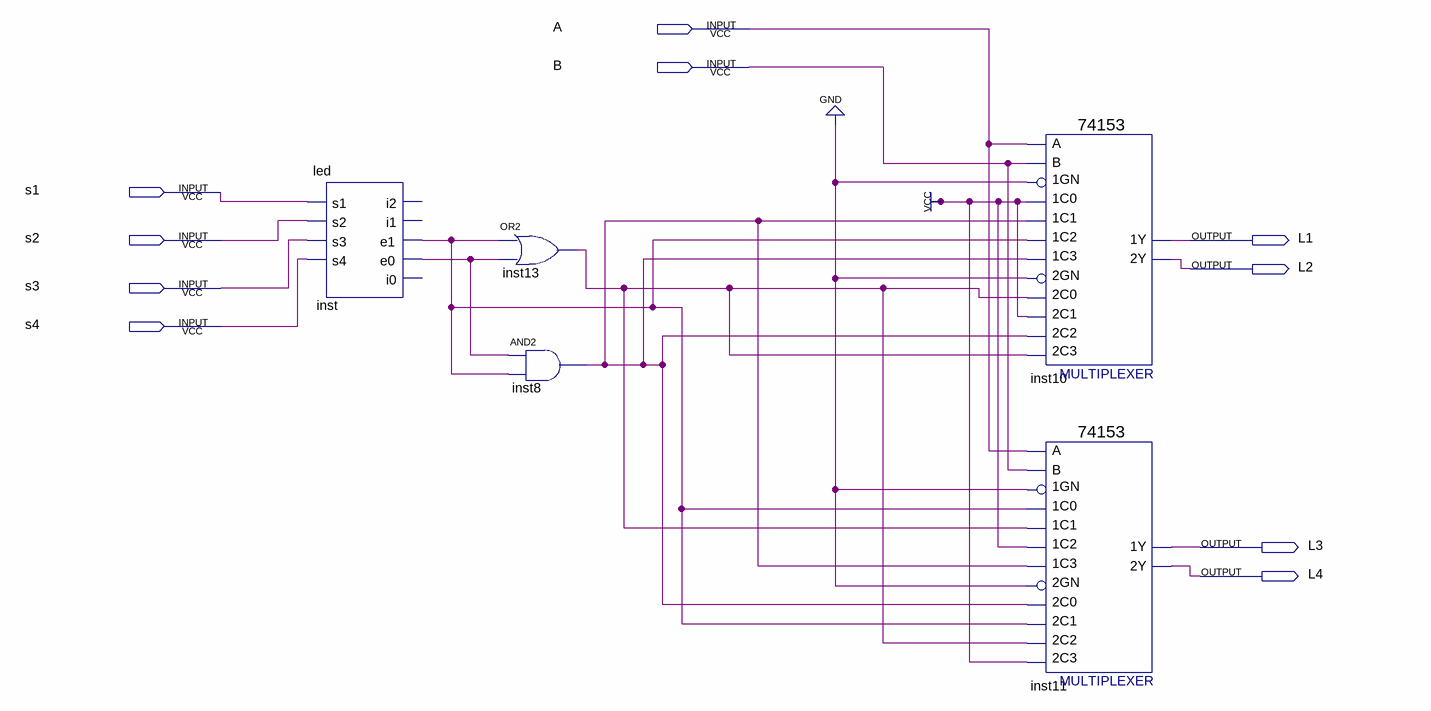
[diagram p0: schematic sheet]
// Quartus schematic finalversion.bdf as structural Verilog: 5 symbols, 10 pins
module finalversion (
  input  A,
  input  B,
  input  s1,
  input  s2,
  input  s3,
  input  s4,
  output L1,
  output L2,
  output L3,
  output L4
);

  wire inst8_out, inst13_out, inst_e0, inst_e1;

  led inst (.s1(s1), .s2(s2), .s3(s3), .s4(s4), .e1(inst_e1), .e0(inst_e0));  // open: i2, i1, i0
  or inst13 (inst13_out, inst_e1, inst_e0);
  and inst8 (inst8_out, inst_e0, inst_e1);
  \74153  inst10 (
    .\1C1 (inst8_out), .\1GN (1'b0), .\1C0 (1'b1), .\2C0 (inst13_out), .\2GN (1'b0), .\2C2 (inst8_out),
    .\1C2 (inst_e1), .\1C3 (inst8_out), .B(B), .A(A), .\2C1 (1'b1), .\2C3 (inst13_out), .\1Y (L1), .\2Y (L2));
  \74153  inst11 (
    .\1C1 (inst13_out), .\1GN (1'b0), .\1C0 (inst_e1), .\2C0 (inst8_out), .\2GN (1'b0), .\2C2 (inst13_out),
    .\1C2 (1'b1), .\1C3 (inst8_out), .B(B), .A(A), .\2C1 (inst_e1), .\2C3 (1'b1), .\1Y (L3), .\2Y (L4));
endmodule
